# EAGLE design fngAfro (EAGLE 7.2.0)
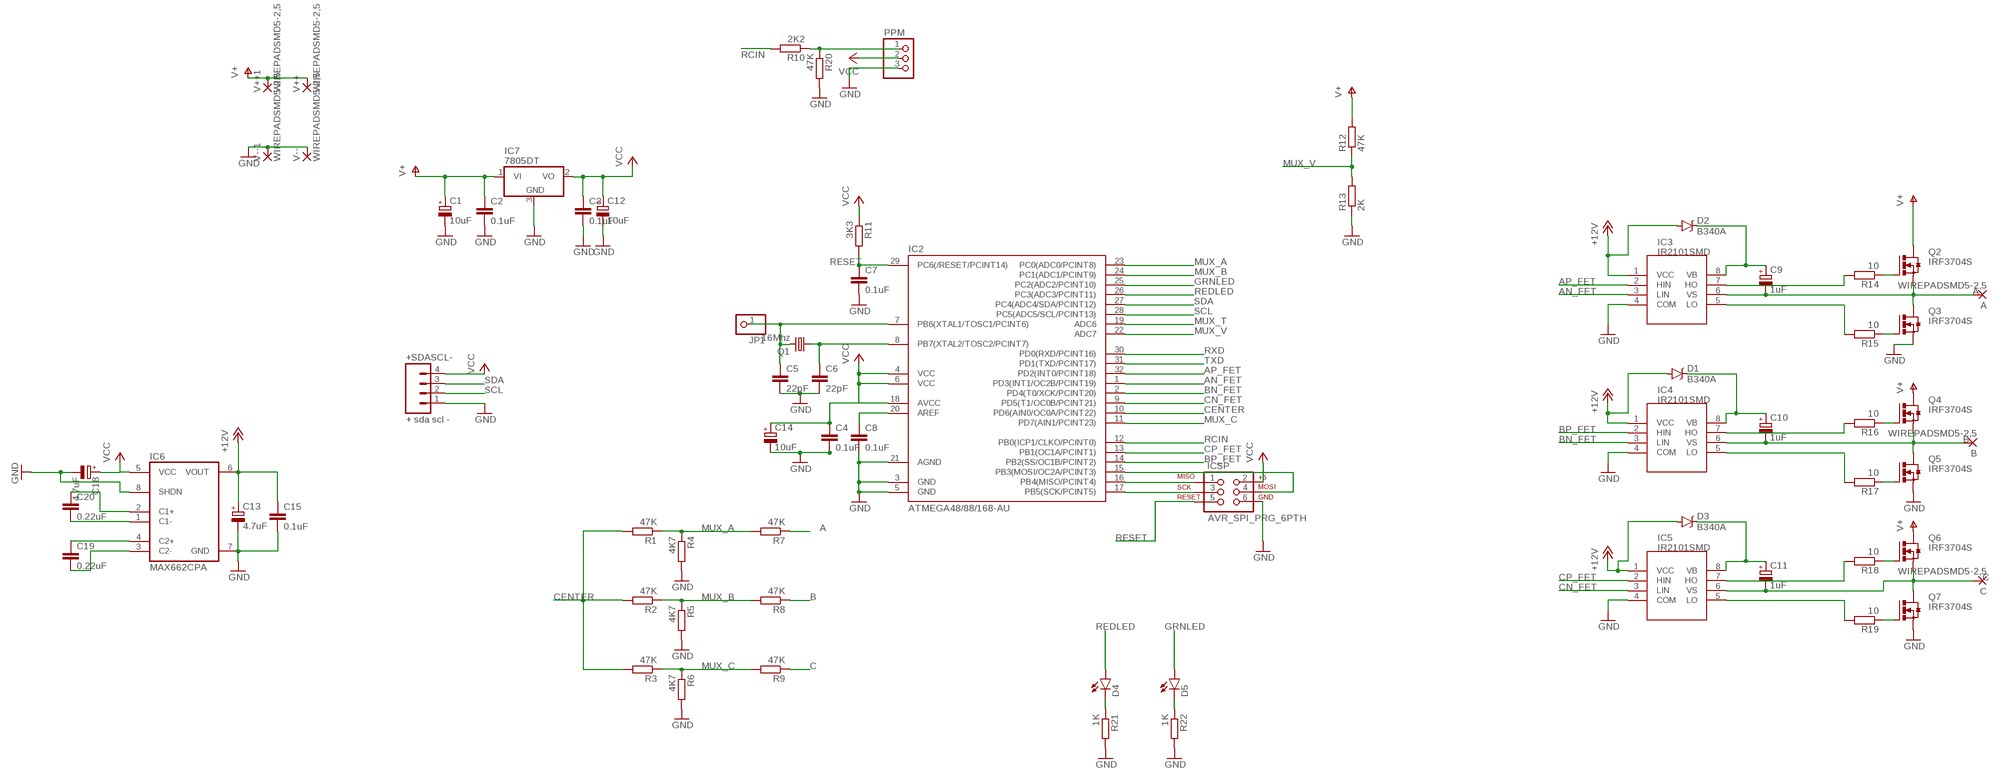
[diagram p0: schematic, sheet 1]

## Parts
+SDASCL-  + sda scl -  M04LOCK  [1X04_LOCK]
A  WIREPADSMD5-2,5  [5-2,5]
B  WIREPADSMD5-2,5  [5-2,5]
C  WIREPADSMD5-2,5  [5-2,5]
C1  10uF  CPOL-EUCT3216  [CT3216]
C2  0.1uF  C-EUC1206K  [C1206K]
C3  0.1uF  C-EUC1206K  [C1206K]
C4  0.1uF  C-EUC1206K  [C1206K]
C5  22pF  C-EUC1206K  [C1206K]
C6  22pF  C-EUC1206K  [C1206K]
C7  0.1uF  C-EUC1206K  [C1206K]
C8  0.1uF  C-EUC1206K  [C1206K]
C9  1uF  CPOL-EUB/3528-21R  [B/3528-21R]
C10  1uF  CPOL-EUB/3528-21R  [B/3528-21R]
C11  1uF  CPOL-EUB/3528-21R  [B/3528-21R]
C12  10uF  CPOL-EUA/3216-18W  [A/3216-18W]
C13  4.7uF  CPOL-EUCT3216  [CT3216]
C14  10uF  CPOL-EUA/3216-18W  [A/3216-18W]
C15  0.1uF  C-EUC1206K  [C1206K]
C18  4.7uF  CPOL-EUCT3216  [CT3216]
C19  0.22uF  C-EUC1206K  [C1206K]
C20  0.22uF  C-EUC1206K  [C1206K]
D1  B340A  DIODE-SCHOTTKY-B340A  [SMA-DIODE]
D2  B340A  DIODE-SCHOTTKY-B340A  [SMA-DIODE]
D3  B340A  DIODE-SCHOTTKY-B340A  [SMA-DIODE]
D4  LED-FKIT-1206  [FKIT-LED-1206]
D5  LED-FKIT-1206  [FKIT-LED-1206]
IC2  ATMEGA48/88/168-AU  [TQFP32-08]
IC3  IR2101SMD  [SO08]
IC4  IR2101SMD  [SO08]
IC5  IR2101SMD  [SO08]
IC6  MAX662CPA  [SO08]
IC7  7805DT  [TO252]
ICSP  AVR_SPI_PRG_6PTH  [2X3]
JP1  PINHD-1X1  [1X01]
PPM  PINHD-1X3  [1X03]
Q1  16Mhz  CRYSTALHC49U70  [HC49U70]
Q2  IRF3704S  [D2PACK]
Q3  IRF3704S  [D2PACK]
Q4  IRF3704S  [D2PACK]
Q5  IRF3704S  [D2PACK]
Q6  IRF3704S  [D2PACK]
Q7  IRF3704S  [D2PACK]
R1  47K  R-EU_M0805  [M0805]
R2  47K  R-EU_M0805  [M0805]
R3  47K  R-EU_M0805  [M0805]
R4  4K7  R-EU_M0805  [M0805]
R5  4K7  R-EU_M0805  [M0805]
R6  4K7  R-EU_M0805  [M0805]
R7  47K  R-EU_M0805  [M0805]
R8  47K  R-EU_M0805  [M0805]
R9  47K  R-EU_M0805  [M0805]
R10  2K2  R-EU_M1206  [M1206]
R11  3K3  R-EU_M1206  [M1206]
R12  47K  R-EU_M0805  [M0805]
R13  2K  R-EU_M0805  [M0805]
R14  10  R-EU_M0805  [M0805]
R15  10  R-EU_M0805  [M0805]
R16  10  R-EU_M0805  [M0805]
R17  10  R-EU_M0805  [M0805]
R18  10  R-EU_M0805  [M0805]
R19  10  R-EU_M0805  [M0805]
R20  47K  R-EU_M1206  [M1206]
R21  1K  R-EU_M0805  [M0805]
R22  1K  R-EU_M0805  [M0805]
V++  WIREPADSMD5-2,5  [5-2,5]
V++1  WIREPADSMD5-2,5  [5-2,5]
V--  WIREPADSMD5-2,5  [5-2,5]
V--1  WIREPADSMD5-2,5  [5-2,5]

## Nets
+12V: C13.+ C15.1 D1.A D2.A D3.A IC3.1(VCC) IC4.1(VCC) IC5.1(VCC) IC6.6(VOUT)
A: A.1(P) C9.- IC3.6(VS) Q2.3(S) Q3.2(D) R7.1
AN_FET: IC2.1(PD3(INT1/OC2B/PCINT19)) IC3.3(LIN)
AP_FET: IC2.32(PD2(INT0/PCINT18)) IC3.2(HIN)
B: B.1(P) C10.- IC4.6(VS) Q4.3(S) Q5.2(D) R8.1
BN_FET: IC2.2(PD4(T0/XCK/PCINT20)) IC4.3(LIN)
BP_FET: IC2.14(PB2(SS/OC1B/PCINT2)) IC4.2(HIN)
C: C11.- C.1(P) IC5.6(VS) Q6.3(S) Q7.2(D) R9.1
CENTER: IC2.10(PD6(AIN0/OC0A/PCINT22)) R1.2 R2.2 R3.2
CN_FET: IC2.9(PD5(T1/OC0B/PCINT21)) IC5.3(LIN)
CP_FET: IC2.13(PB1(OC1A/PCINT1)) IC5.2(HIN)
GND: +SDASCL-.1 C1.- C2.2 C3.2 C4.2 C5.2 C6.2 C7.2 C8.2 C12.- C13.- C14.- C15.2 C18.- IC2.3(GND) IC2.5(GND) IC2.21(AGND) IC3.4(COM) IC4.4(COM) IC5.4(COM) IC6.7(GND) IC6.8(SHDN) IC7.3(GND) ICSP.6 PPM.3 Q3.3(S) Q5.3(S) Q7.3(S) R4.2 R5.2 R6.2 R13.1 R20.2 R21.2 R22.2 V--1.1(P) V--.1(P)
GRNLED: D5.A IC2.25(PC2(ADC2/PCINT10))
MUX_A: IC2.23(PC0(ADC0/PCINT8)) R1.1 R4.1 R7.2
MUX_B: IC2.24(PC1(ADC1/PCINT9)) R2.1 R5.1 R8.2
MUX_C: IC2.11(PD7(AIN1/PCINT23)) R3.1 R6.1 R9.2
MUX_T: IC2.19(ADC6)
MUX_V: IC2.22(ADC7) R12.1 R13.2
N$1: IC2.17(PB5(SCK/PCINT5)) ICSP.3
N$2: IC2.16(PB4(MISO/PCINT4)) ICSP.1
N$3: IC2.15(PB3(MOSI/OC2A/PCINT3)) ICSP.4
N$4: Q2.1(G) R14.1
N$5: IC4.7(HO) R16.2
N$6: Q3.1(G) R15.1
N$7: IC4.5(LO) R17.2
N$8: IC5.7(HO) R18.2
N$9: Q4.1(G) R16.1
N$10: IC5.5(LO) R19.2
N$11: Q5.1(G) R17.1
N$13: Q6.1(G) R18.1
N$15: Q7.1(G) R19.1
N$17: C19.1 IC6.4(C2+)
N$18: IC3.7(HO) R14.2
N$19: IC3.5(LO) R15.2
N$20: C19.2 IC6.3(C2-)
N$21: D4.C R21.1
N$23: C6.1 IC2.8(PB7(XTAL2/TOSC2/PCINT7)) Q1.1
N$24: C5.1 IC2.7(PB6(XTAL1/TOSC1/PCINT6)) JP1.1 Q1.2
N$25: C8.1 IC2.20(AREF)
N$26: PPM.1 R10.1 R20.1
N$31: D5.C R22.1
N$32: C20.2 IC6.1(C1-)
N$33: C20.1 IC6.2(C1+)
RCIN: IC2.12(PB0(ICP1/CLKO/PCINT0)) R10.2
REDLED: D4.A IC2.26(PC3(ADC3/PCINT11))
RESET: C7.1 IC2.29(PC6(/RESET/PCINT14)) ICSP.5 R11.2
RXD: IC2.30(PD0(RXD/PCINT16))
SCL: +SDASCL-.2 IC2.28(PC5(ADC5/SCL/PCINT13))
SDA: +SDASCL-.3 IC2.27(PC4(ADC4/SDA/PCINT12))
TXD: IC2.31(PD1(TXD/PCINT17))
V+: C1.+ C2.1 IC7.1(VI) Q2.2(D) Q4.2(D) Q6.2(D) R12.2 V++1.1(P) V++.1(P)
VBA: C9.+ D2.C IC3.8(VB)
VBB: C10.+ D1.C IC4.8(VB)
VBC: C11.+ D3.C IC5.8(VB)
VCC: +SDASCL-.4 C3.1 C4.1 C12.+ C14.+ C18.+ IC2.4(VCC) IC2.6(VCC) IC2.18(AVCC) IC6.5(VCC) IC7.2(VO) ICSP.2 PPM.2 R11.1

## Library data of the parts
+SDASCL- = SparkFun-Connectors:M04: Header 4 Standard 4-pin 0.1" header. Use with straight break away headers (SKU : PRT-00116), right angle break away headers (PRT-00553), swiss pins (PRT-00743), machine pins (PRT-00117), and female headers (PRT-00115). Molex polarized connector foot print use with SKU : PRT-08231 with associated crimp pins and housings. 1MM SMD Version SKU: PRT-10208; PROD_ID: CONN-09696
A B C V++ V++1 V-- V--1 = wirepad:WIREPAD: Wire PAD connect wire on PCB
C1 C9-C14 C18 = rcl:CPOL-EU: POLARIZED CAPACITOR, European symbol
C2-C8 C15 C19 C20 = rcl:C-EU: CAPACITOR, European symbol
D1-D3 = SparkFun-DiscreteSemi:DIODE-SCHOTTKY: Schottky diodes in SFE's production catalog BAT20J 1A 23V 0.62Vf RB751 120mA 40V 0.37Vf PMEG4005EJ 0.5A 40V 0.42Vf MBRA140 1A 40V 0.5Vf B340A 3A 40V SMA; PROD_ID: DIO-09886
D4 D5 = SparkFun-LED:LED: LEDs Standard schematic elements and footprints for 5mm, 3mm, 1206, and 0603 sized LEDs. 5mm - Spark Fun Electronics SKU : COM-00529 (and others)
IC2 = atmega8:ATMEGA48/88/168
IC3-IC5 = fng:IR2101
IC6 = fng:MAX662CPA: SUPPLY CHARGE PUMP
IC7 = adafruit:78*: Positive VOLTAGE REGULATOR Added bigger pads to the TO-92 package
ICSP = SparkFun-Connectors:AVR_SPI_PRG_6: AVR ISP 6 Pin This is the reduced ISP connector for AVR programming. Common on Arduino. This footprint will take up less PCB space and can be used with a 10-pin to 6-pin adapter such as SKU: BOB-08508 **Special note about "TEST_POINT" package. The stop mask is on the top side, so if you want your programming test points to be on the bottom of your board, make sure to place this package on the bottom side of the board. This also ensure that the orientation to program from the bottom side will be correct.
JP1 = pinhead:PINHD-1X1: PIN HEADER
PPM = pinhead:PINHD-1X3: PIN HEADER
Q1 = crystal:CRYSTAL: CRYSTAL; OC_FARNELL: unknown; OC_NEWARK: unknown
Q2-Q7 = transistor-power:IRF3704: SMPS MOSFET HEXFET® Power MOSFET Source: http://www.irf.com/product-info/datasheets/data/irf3704.pdf
R1-R22 = rcl:R-EU_: RESISTOR, European symbol

## Board
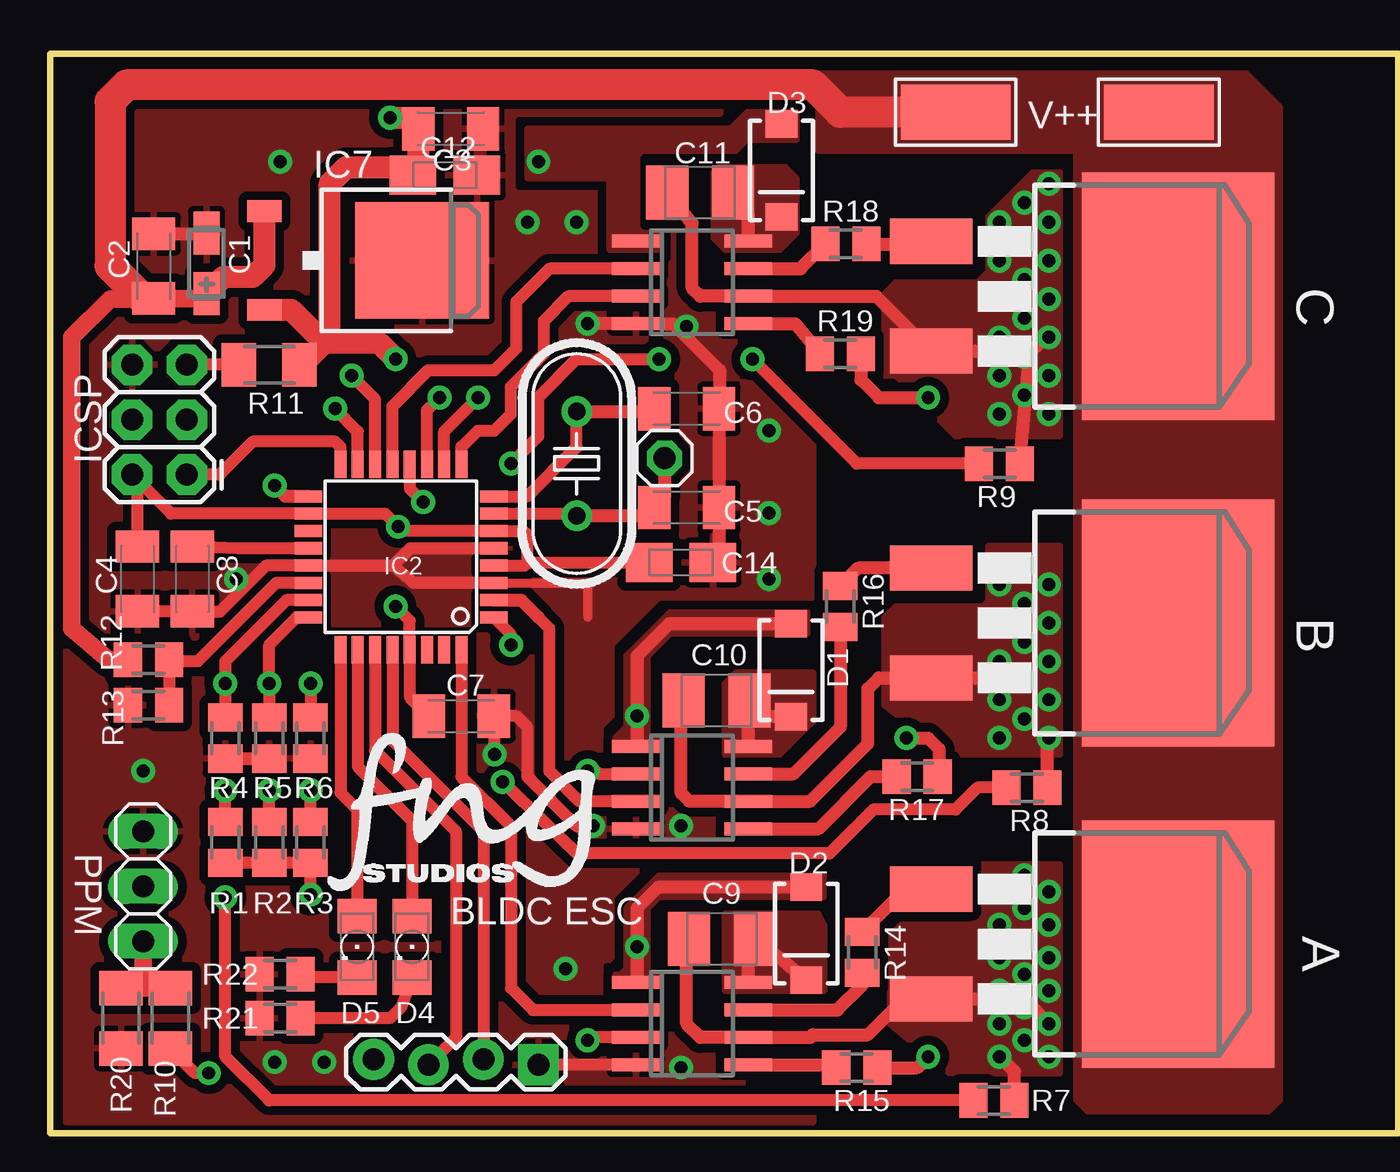
[diagram p1: board, top side]
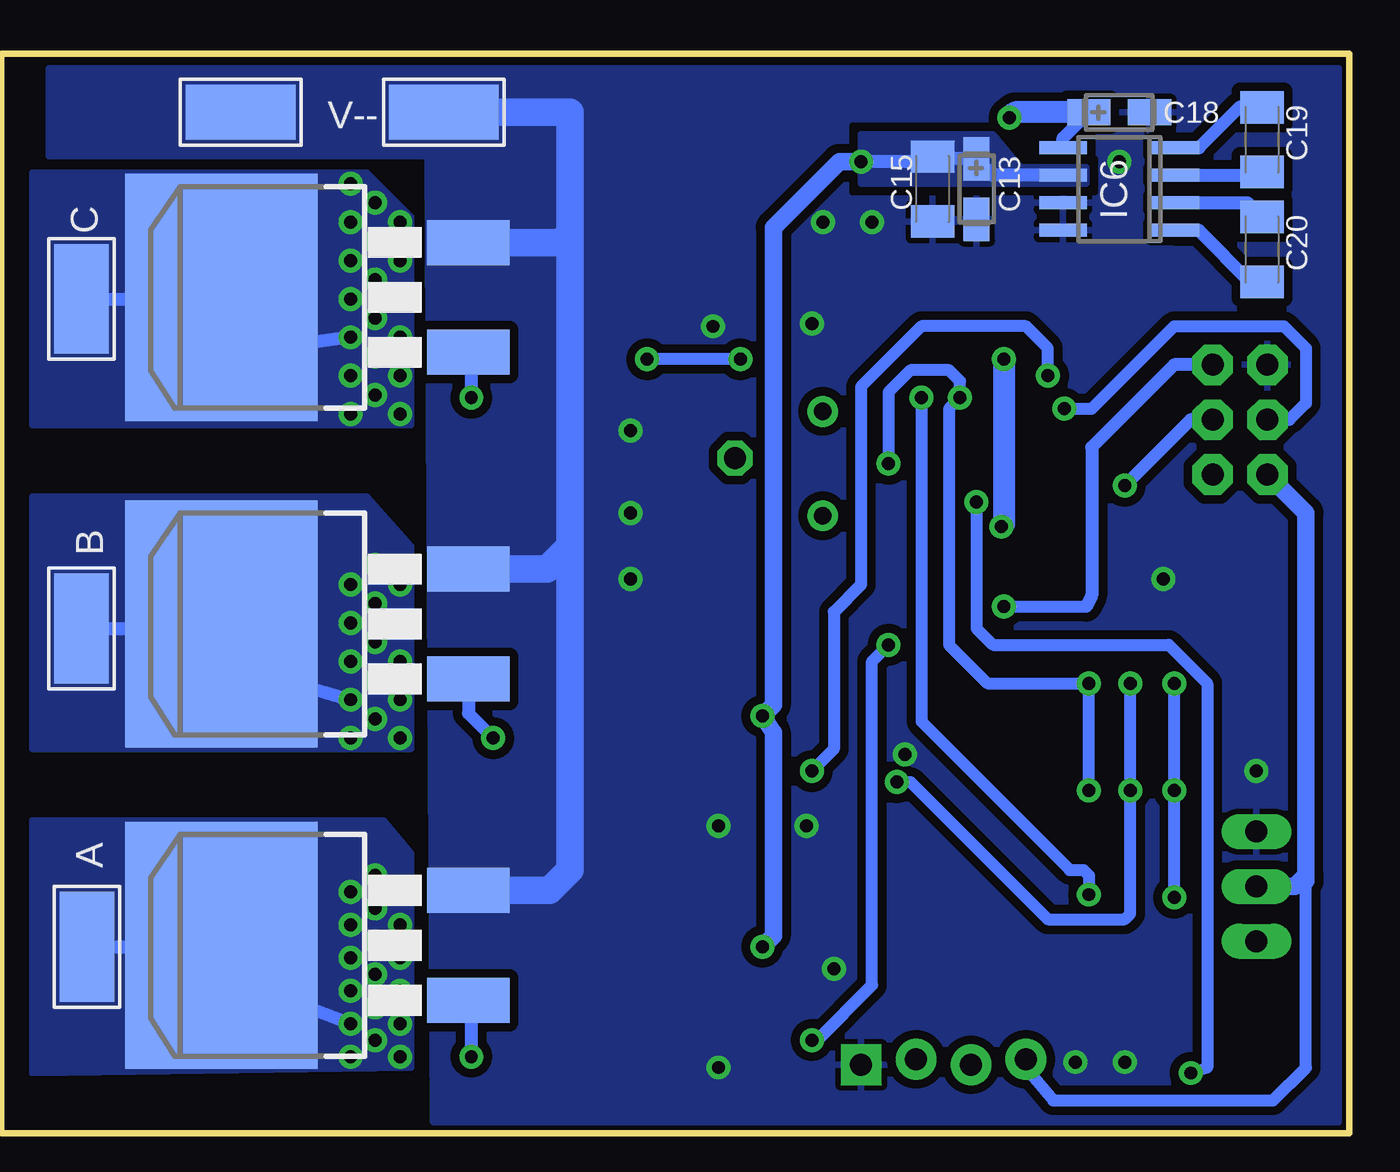
[diagram p2: board, bottom side, seen from below]

No outline drawn. Coordinates in mm, seen from the top.
Copper layers (1*16): Top 0.035mm / dielectric 1.5mm / Bottom 0.035mm
Design rules "SparkFun *": minimum track width 4mil, minimum drill 20mil, track to track 8mil, track to pad 8mil, pad to pad 8mil, via to via 8mil, smd to smd 8mil, copper to edge 10mil, drill to drill 8mil, minimum pad ring 12mil, minimum via ring 10mil, stop-mask expansion 4mil, vias tented up to drill 25mil, thermal gap 10mil
Milling: 4 lines

### Footprints (pad centres in the part's own frame; a part is rotated, then mirrored left to right if it is on the bottom)
1X04_LOCK = drill 1.016 pad 1.88 square: 1 0,0.127 | drill 1.016 pad 1.88: 2 2.54,-0.127; 3 5.08,0.127; 4 7.62,-0.127
5-2,5 = smd 2.54 x 5.08: 1 0,0
CT3216 = smd 2 x 1.2: + -1.4,0; - 1.4,0
C1206K = smd 1.5 x 2: 1 -1.5,0; 2 1.5,0
B/3528-21R = smd 1.95 x 2.5: + 1.525,0; - -1.525,0
A/3216-18W = smd 2.15 x 1.8: + 1.475,0; - -1.475,0
SMA-DIODE = smd 1.27 x 1.47: A -2.15,0; C 2.15,0
FKIT-LED-1206 = smd 1.6 x 1.803: A -1.422,0; C 1.422,0
TQFP32-08 = smd 1.27 x 0.559: 1 -4.293,2.8; 2 -4.293,2; 3 -4.293,1.2; 4 -4.293,0.4; 5 -4.293,-0.4; 6 -4.293,-1.2; 7 -4.293,-2; 8 -4.293,-2.8; 17 4.293,-2.8; 18 4.293,-2; 19 4.293,-1.2; 20 4.293,-0.4; 21 4.293,0.4; 22 4.293,1.2; 23 4.293,2; 24 4.293,2.8 | smd 0.559 x 1.27: 9 -2.8,-4.293; 10 -2,-4.293; 11 -1.2,-4.293; 12 -0.4,-4.293; 13 0.4,-4.293; 14 1.2,-4.293; 15 2,-4.293; 16 2.8,-4.293; 25 2.8,4.293; 26 2,4.293; 27 1.2,4.293; 28 0.4,4.293; 29 -0.4,4.293; 30 -1.2,4.293; 31 -2,4.293; 32 -2.8,4.293
SO08 = smd 0.6 x 2.2: 1 -1.905,-2.6; 2 -0.635,-2.6; 3 0.635,-2.6; 4 1.905,-2.6; 5 1.905,2.6; 6 0.635,2.6; 7 -0.635,2.6; 8 -1.905,2.6
TO252 = smd 1 x 1.6: 1 -2.28,-4.8; 2 2.28,-4.8 | smd 5.4 x 6.2: 3 0,2.5
2X3 = drill 1.016 pad 1.88 octagon: 1 0,0; 2 0,2.54; 3 2.54,0; 4 2.54,2.54; 5 5.08,0; 6 5.08,2.54
1X01 = drill 1.016 octagon: 1 0,0
1X03 = drill 1.016 long: 1 -2.54,0; 2 0,0; 3 2.54,0
HC49U70 = drill 0.813: 1 -2.413,0; 2 2.413,0
D2PACK = smd 2.083 x 3.81: 1 -2.54,-8.89; 3 2.54,-8.89 | smd 11.43 x 8.89: 2 0,2.54
M0805 = smd 1.3 x 1.6: 1 -0.95,0; 2 0.95,0
M1206 = smd 1.6 x 2: 1 -1.4,0; 2 1.4,0

### Placement (x,y rotation side)
+SDASCL-  22.61,3.3 180 top
A  58.42,8.64 0 bottom
B  58.67,23.37 180 bottom
C  58.67,38.61 0 bottom
C1  7.26,40.25 90 top
C2  4.82,40.12 90 top
C3  18.55,46.47 0 top
C4  4.06,25.65 270 top
C5  29.46,28.96 0 top
C6  29.46,33.53 0 top
C7  19.05,19.3 0 top
C8  6.6,25.65 270 top
C9  31.11,9 0 top
C10  30.85,20.04 0 top
C11  30.09,43.52 0 top
C12  18.29,44.32 180 top
C13  17.27,43.69 270 bottom
C14  29.21,26.42 180 top
C15  19.3,43.69 270 bottom
C18  10.67,47.24 0 bottom
C19  4.06,45.97 270 bottom
C20  4.06,40.89 270 bottom
D1  34.3,21.43 270 top
D2  34.99,9.24 270 top
D3  33.85,44.54 270 top
D4  16.76,8.64 270 top
D5  14.22,8.64 270 top
IC2  16.26,26.67 180 top
IC3  29.72,5.08 270 top
IC4  29.72,16 270 top
IC5  29.72,39.37 270 top
IC6  10.67,43.69 90 bottom
IC7  14.73,40.39 270 top
ICSP  6.35,30.48 90 top
JP1  28.45,31.24 0 top
PPM  4.32,11.43 90 top
Q1  24.38,30.99 270 top
Q2  49.66,8.76 270 top
Q3  49.66,8.7 90 bottom
Q4  49.66,23.62 270 top
Q5  49.66,23.56 90 bottom
Q6  49.66,38.73 270 top
Q7  49.66,38.68 90 bottom
R1  8.13,13.46 270 top
R2  10.16,13.46 270 top
R3  12.06,13.46 270 top
R4  8.13,18.29 270 top
R5  10.16,18.29 270 top
R6  12.06,18.29 270 top
R7  43.68,1.53 180 top
R8  45.21,16 180 top
R9  43.94,30.99 180 top
R10  5.59,5.33 270 top
R11  10.16,35.56 180 top
R12  4.57,21.91 180 top
R13  4.57,19.82 0 top
R14  37.59,8.38 270 top
R15  37.34,3.05 180 top
R16  36.58,24.38 270 top
R17  40.13,16.51 180 top
R18  36.83,41.15 180 top
R19  36.58,36.07 180 top
R20  3.3,5.33 270 top
R21  10.67,5.33 180 top
R22  10.67,7.37 180 top
U$2  [LOGOFNGNAME1]  12.19,10.16 0 top
V++  51.31,47.24 90 top
V++1  41.91,47.24 90 top
V--  41.91,47.24 90 bottom
V--1  51.31,47.24 270 bottom

### Tracks (layer width: path | path; a pad name or v marks a point on that pad's centre or on a via)
+12V  (via drill 0.6)
  Top 0.61: 33.55,46.99 D3.A | IC5.1 27.05,41.27 | D1.A 28.66,23.58 27.18,22.1 27.18,17.97 IC4.1 | D2.A 28.15,11.39 27.18,10.41 27.18,7.04 IC3.1
  Bottom 0.61: IC6.6 16.51,44.32 C13.+ 19.2,45.09 C15.1 19.3,44.96 v22.61,44.96
  Bottom 0.813: v22.61,44.96 23.62,44.96 26.67,41.91 26.67,19.81 v27.18,19.3 26.67,18.54 26.67,9.14 v27.18,8.64
  pour Bottom (no thermals): 12.19,44.7 15.24,44.7 16.51,46.23 22.61,46.23 22.61,43.94 12.19,43.94
  pour Top (no thermals): 22.1,44.2 22.1,46.48 31.5,46.48 32.26,47.24 34.54,47.24 34.54,45.97 32.26,45.97 31.75,45.47 27.43,45.47 27.18,45.21 27.18,41.91 27.43,41.66 28.19,41.66 28.19,40.89 25.91,40.89 25.91,44.2
  pour Top (no thermals): 28.19,17.78 28.19,18.29 27.69,18.29 27.69,22.1 28.7,23.11 35.05,23.11 35.05,24.13 28.7,24.13 26.67,22.1 26.67,18.8 26.16,18.29 26.16,17.78
  pour Top (no thermals): 28.19,6.86 28.19,7.37 27.69,7.37 27.69,10.41 28.19,10.92 35.81,10.92 35.81,11.94 28.19,11.94 26.67,10.41 26.67,7.62 26.42,7.37 26.16,7.37 26.16,6.86
A  (via drill 0.6)
  Top 0.61: C9.- 29.46,8.11 29.46,5.08 30.1,4.45 IC3.6 35.18,4.45 35.31,4.57 37.85,4.57 39.37,6.1 40.65,6.1 Q2.3 45.08,6.22 v46.23,5.08 45.08,6.22 | R7.1 44.63,2.87 v43.94,3.56
  Bottom 0.61: A.1 52.02,8.64 Q3.2 49.6,6.35 v46.23,5.08
  other vias: 46.23,3.56 45.09,4.32 45.09,5.84 43.94,5.08 45.09,7.37 46.23,6.6 46.23,8.13 46.23,11.18 45.09,10.41 45.09,8.89 43.94,6.6 43.94,8.13 43.94,11.18 43.94,9.65 46.23,9.65 45.09,11.94
  pour Bottom (no thermals): 43.43,12.95 43.43,3.05 60.96,2.79 60.96,14.48 44.7,14.48
  pour Top (isolate 0.406, no thermals): 38.86,5.08 38.86,9.14 39.37,9.65 42.67,9.65 43.18,10.16 43.18,12.45 46.74,12.45 46.74,2.79 41.66,2.79
AN_FET  (via drill 0.6)
  Top 0.559: IC3.3 25.02,4.45 v24.89,4.32 | v21.34,22.61 21.34,23.08 IC2.1
  Bottom 0.559: v24.89,4.32 24.64,4.32 22.1,6.86 22.1,21.84 v21.34,22.61
AP_FET
  Top 0.559: IC2.32 19.06,16.5 21.34,14.22 21.34,6.73 22.35,5.71 IC3.2
B  (via drill 0.6)
  Top 0.61: C10.- 29.21,19.14 29.21,15.75 29.59,15.37 IC4.6 35.18,15.37 37.85,18.03 37.85,20.57 38.35,21.08 Q4.3 | Q4.3 | Q4.3 45.21,21.08 | R8.1 46.16,18.22 v46.23,18.29
  Bottom 0.61: B.1 52.4,23.37 Q5.2 49.72,21.08 v46.23,20.07
  other vias: 43.94,18.29 45.09,19.18 43.94,20.07 45.09,20.95 43.94,21.84 46.23,21.84 45.09,22.73 46.23,23.62 43.94,23.62 45.09,24.51 46.23,25.4 43.94,25.4 45.09,26.29
  pour Bottom (no thermals): 43.43,17.78 60.96,17.78 60.96,29.46 45.47,29.46 43.43,27.18
  pour Top (isolate 0.406, no thermals): 38.61,19.81 38.61,23.88 39.12,24.38 43.18,24.38 43.43,24.64 43.43,27.18 46.74,27.18 46.74,17.53 41.66,17.53
BN_FET
  Top 0.559: 22.61,23.87 23.11,23.37 23.11,16.76 24.51,15.37 IC4.3
  Top 0.61: IC2.2 21.81,24.67 22.61,23.87
BP_FET  (via drill 0.6)
  Top 0.559: IC2.14 15.06,33.97 v13.97,35.05 | v24.89,16.76 25.27,16.76 25.4,16.64 IC4.2
  Bottom 0.559: v13.97,35.05 13.97,36.32 14.99,37.34 19.81,37.34 22.61,34.54 22.61,25.4 23.88,24.13 23.88,17.78 v24.89,16.76
C  (via drill 0.6)
  Top 0.61: C11.- 29.72,42.11 29.72,39.12 30.1,38.73 IC5.6 38.23,38.73 Q6.3 | Q6.3 | Q6.3 45.33,36.19 45.34,36.2 | R9.1 45.34,36.2 | 45.34,36.2 v46.23,36.83
  Bottom 0.61: C.1 52.28,38.61 Q7.2 49.85,36.32 v46.23,36.83
  other vias: 43.94,40.39 46.23,43.94 46.23,40.39 46.23,38.61 43.94,38.61 43.94,36.83 46.23,35.05 46.23,33.27 43.94,33.27 43.94,35.05 45.09,39.5 45.09,37.72 45.09,34.16 45.09,35.94 45.09,41.27 43.94,42.16 45.09,43.05 46.23,42.16
  pour Bottom (no thermals): 43.43,32.77 60.96,32.77 60.96,44.45 45.47,44.45 43.43,42.42
  pour Top (isolate 0.406, no thermals): 38.61,35.05 38.61,38.86 39.12,39.37 42.93,39.37 43.43,39.88 43.43,42.42 45.47,44.45 46.74,44.45 46.74,32.26 41.91,32.26 39.12,35.05
CENTER  (via drill 0.6)
  Top 0.559: IC2.10 18.26,32.48 v19.81,34.04 | v12.06,11.05 R3.2 R2.2 R1.2
  Bottom 0.559: v19.81,34.04 19.81,19.05 12.95,12.19 12.32,12.19 12.06,11.94 v12.06,11.05
CN_FET
  Top 0.559: IC5.3 24,38.73 22.86,37.59 22.86,36.07 21.34,34.54 21.34,33.27 20.57,32.51 19.81,32.51 19.06,31.76 IC2.9
CP_FET
  Top 0.559: IC5.2 23.11,40.01 21.59,38.48 21.59,36.32 20.57,35.31 17.53,35.31 15.86,33.64 IC2.13
GND  (via drill 0.6)
  Top 0.406: IC2.3 24.89,25.47 24.89,23.88
  Top 0.559: 15.89,26.27 IC2.21 10.01,26.27 7.87,24.13 7.39,24.13 C8.2 C4.2 | IC2.5 16.69,27.07 15.89,26.27 | IC2.3 16.82,25.47 16.76,25.53 15.89,26.27 | R4.2 8.13,17.27 | IC3.4 +SDASCL-.1 | v25.15,14.22 24.38,14.22 22.1,16.51 22.1,18.8 21.59,19.3 C7.2 20.57,19.28 v20.57,17.53
  Top 0.61: R4.2 R5.2 | C2.2 7.23,41.62 C1.- | 30.99,25.91 30.99,28.93 C5.2 C6.2 30.99,33.55 30.99,35.31 28.83,37.47 IC5.4 v24.89,37.47 | 19.81,44.75 C12.-
  Bottom 1.27: V--.1 36.07,47.24 36.07,41.66 | Q7.3 36.5,41.22 36.07,41.66 | Q5.3 37.14,26.1 36.07,27.18 | 36.07,27.18 36.07,41.66 | Q3.3 37.02,11.24 36.07,12.19 36.07,27.18
  other vias: 23.88,7.62 29.21,14.22 10.41,3.3 12.7,3.3 8.64,25.65 29.21,3.05 29.46,37.34 33.27,32.51 33.27,28.7 4.32,16.76 22.1,42.16 24.38,42.16 33.27,25.65 10.67,44.96
  pour Top (isolate 0.406, rank 2): 0.76,49.28 35.31,49.28 35.31,0.51 0.76,0.51
  pour Bottom (isolate 0.406, no thermals): 60.2,49.28 60.2,45.21 42.67,45.21 42.42,0.51 33.27,0.51 34.04,47.75 34.29,49.28
  pour Bottom (isolate 0.406, rank 2): 0.51,49.28 37.59,49.28 37.59,0.51 0.51,0.51
GRNLED
  Top 0.559: IC2.25 13.46,15.75 14.22,14.99 D5.A
MUX_A  (via drill 0.6)
  Top 0.559: IC2.23 10.95,24.67 8.13,21.84 v8.13,20.83 R4.1 | R1.1 v8.13,15.88 | R7.2 10.15,1.53 8.13,3.56 v8.13,10.92
  Bottom 0.559: v8.13,20.83 v8.13,15.88 v8.13,10.92
MUX_B  (via drill 0.6)
  Top 0.559: IC2.24 11.42,23.87 10.16,22.61 v10.16,20.83 R5.1 | R2.1 v10.16,15.88 | R8.2 42.93,16 41.91,14.99 38.1,14.99 36.07,12.95 24.38,12.95 v20.95,16.26
  Bottom 0.559: v10.16,20.83 v10.16,15.88 10.16,10.16 10.41,9.91 13.97,9.91 20.32,16.26 v20.95,16.26
MUX_C  (via drill 0.6)
  Top 0.559: R3.1 v12.06,15.88 | v12.06,20.83 R6.1 | IC2.11 17.46,33.46 v18.03,34.04 | R9.2 37.34,30.99 v32.51,35.81 | v28.19,35.81 24.38,35.81 22.61,34.04 22.61,32.26 v21.34,30.99
  Bottom 0.559: v12.06,15.88 v12.06,20.83 16.76,20.83 18.54,22.61 18.54,33.53 v18.03,34.04 18.03,34.8 18.54,35.31 20.32,35.31 21.34,34.29 v21.34,30.99 | v28.19,35.81 v32.51,35.81
MUX_V
  Top 0.559: IC2.22 10.48,25.47 6.86,21.84 5.59,21.84 R12.1 R13.2
N$1  (via drill 0.6)
  Top 0.61: IC2.17 10.92,29.47 v10.41,29.97
  Bottom 0.61: ICSP.3 7.37,33.02 v10.41,29.97
N$2
  Top 0.406: IC2.16
  Top 0.559: IC2.16 13.46,31.76 13.21,32 9.4,32 7.87,30.48 ICSP.1
N$3  (via drill 0.6)
  Top 0.559: IC2.15 14.26,32.48 v13.21,33.53
  Bottom 0.559: v13.21,33.53 11.94,33.53 8.13,37.34 3.05,37.34 2.03,36.32 2.03,33.78 2.79,33.02 ICSP.4
N$4
  Top 0.61: Q2.1 39.56,11.3 R14.1
N$5
  Top 0.61: IC4.7 34.42,16.64 36.58,18.8 R16.2
N$6  (via drill 0.6)
  Top 0.61: R15.1 40.13,3.05 v40.64,3.56
  Bottom 0.61: v40.64,3.56 40.64,6.03 Q3.1
N$7
  Top 0.61: IC4.5 35.56,14.1 37.97,16.51 R17.2
N$8
  Top 0.61: IC5.7 34.74,40.01 R18.2
N$9
  Top 0.61: Q4.1 37.4,26.16 R16.1
N$10
  Top 0.61: IC5.5 34.48,37.47 R19.2
N$11  (via drill 0.6)
  Top 0.61: v39.62,18.29 40.64,18.29 41.15,17.78 41.15,16.58 R17.1
  Bottom 0.61: Q5.1 40.77,19.44 v39.62,18.29
N$13
  Top 0.61: R18.1 40.65,41.15 Q6.1
N$15  (via drill 0.6)
  Top 0.61: R19.1 37.53,34.86 38.35,34.04 v40.64,34.04
  Bottom 0.61: v40.64,34.04 40.64,36.01 Q7.1
N$17
  Bottom 0.61: IC6.4 6.99,45.59 5.08,47.5 4.09,47.5 C19.1
N$18
  Top 0.61: IC3.7 36.45,5.71 37.59,6.86 R14.2
N$19
  Top 0.61: IC3.5 36.26,3.17 R15.2
N$20
  Bottom 0.61: IC6.3 4.21,44.32 C19.2
N$21
  Top 0.559: D4.C 16.26,5.84 15.75,5.33 R21.1
N$23
  Top 0.559: IC2.8 22.1,29.47 24.38,31.75 Q1.1
  Top 0.61: Q1.1 27.84,33.4 C6.1
N$24
  Top 0.559: IC2.7 24.29,28.67
  Top 0.61: 24.29,28.67 Q1.2 27.58,28.57 | 27.58,28.57 C5.1 | JP1.1 28.45,29.49 27.58,28.57
N$25
  Top 0.559: IC2.20 8.72,27.07 C8.1
N$26
  Top 0.813: R10.1 4.32,6.73 | 4.32,6.73 PPM.1 | R20.1 4.32,6.73
N$31
  Top 0.559: D5.C 11.77,7.21 R22.1
N$32
  Bottom 0.61: IC6.1 6.99,41.78 4.57,39.37 4.09,39.37 C20.2
N$33
  Bottom 0.61: IC6.2 4.72,43.05 C20.1
RCIN  (via drill 0.6)
  Top 0.559: IC2.12 16.66,29.83 v17.27,29.21 | 5.72,4.06 R10.2 6.73,2.79 v7.37,2.79
  Bottom 0.559: v17.27,29.21 17.27,23.37 16.51,22.61 8.38,22.61 6.6,20.83 6.6,3.05 v7.37,2.79
REDLED
  Top 0.559: IC2.26 14.26,16.99 16.76,14.48 D4.A
RESET  (via drill 0.6)
  Top 0.559: v16,24.38 16.66,23.73 IC2.29 16.66,20.2 C7.1 | ICSP.5 R11.2 8.66,35.46
  Bottom 0.559: v16,24.38 12.19,24.38
  Bottom 0.61: ICSP.5 8.13,35.56 11.94,31.75 11.94,24.89 12.19,24.38
SCL
  Top 0.559: IC2.28 15.86,18.18 20.07,13.97 +SDASCL-.2
SDA
  Top 0.559: IC2.27 15.06,17.71 18.8,13.97 18.8,4.45 +SDASCL-.3
V+
  Top 0.813: R12.2 2.73,21.91 1.02,23.37 1.02,36.83 2.79,38.61 4.32,38.61 4.8,38.61 C2.1 7.03,38.62 C1.+
  Top 1.016: IC7.1 9.93,40.16 9.4,39.62 8.03,39.62 C1.+
  Top 1.422: V++1.1 36.58,47.24 35.31,48.51 3.56,48.51 2.79,47.75 2.79,40.13 4.32,38.61
  pour Top (no thermals): 35.56,49.02 55.37,49.02 56.9,47.5 56.9,1.52 56.39,1.02 48.01,1.02 47.5,1.52 47.5,45.47 35.56,45.47
VBA
  Top 0.61: IC3.8 32.32,8.3 C9.+ 33.79,8.1 D2.C
  pour Top (no thermals): 31.24,6.6 35.81,6.6 35.81,9.65 35.56,10.16 31.24,10.16
VBB
  Top 0.61: IC4.8 32.32,19.08 32.33,19.33 | 32.33,19.33 C10.+ | D1.C 32.39,19.28 32.33,19.33
  pour Top (no thermals): 31.24,17.53 33.78,17.53 35.31,19.05 35.31,21.34 31.75,21.34 31.24,20.83
VBC
  Top 0.61: IC5.8 32.32,42.56 C11.+ 32.03,44.18
  pour Top (no thermals): 31.24,40.89 33.78,40.89 34.54,41.66 34.54,44.2 34.04,44.7 30.99,44.7 30.73,44.45 30.73,41.4
VCC  (via drill 0.6)
  Top 0.559: IC2.4 21.95,26.27 22.1,26.42 | 22.1,26.42 22.1,27.69 21.91,27.87 IC2.6 16.33,27.87 v16.13,28.07 15.53,28.67 IC2.18 5.62,28.67 ICSP.2 4.06,30.23 C4.1 | 22.1,26.42 C14.+
  Top 1.016: R11.1 11.68,35.56 12.7,36.58 | 12.7,36.58 12.95,36.58 | 12.95,36.58 15.24,36.58 v16,35.81 | IC7.2 11.17,38.11 12.7,36.58 | 12.95,36.58 12.95,43.94 13.72,44.7 16.43,44.7 C12.+ 17.05,44.56 C3.1 16.53,46.99 v15.75,46.99
  Top 1.27: 16.76,44.66 C12.+
  Bottom 0.559: +SDASCL-.4 14.99,3.05 13.72,1.52 3.56,1.52 2.03,3.05 2.03,11.68
  Bottom 0.61: IC6.5 13.27,46.04 C18.+
  Bottom 0.813: 2.03,11.68 2.03,11.94 | 2.03,11.94 2.03,28.7 ICSP.2 | PPM.2 2.54,11.43 2.03,11.94
  Bottom 1.016: v16,35.81 16,28.19 v16.13,28.07 | C18.+ 15.49,47.24 v15.75,46.99

### Text on the board
tNames: C | B | BLDC ESC | A